# EAGLE schematic ESP12E Brain (EAGLE 9.3.0)
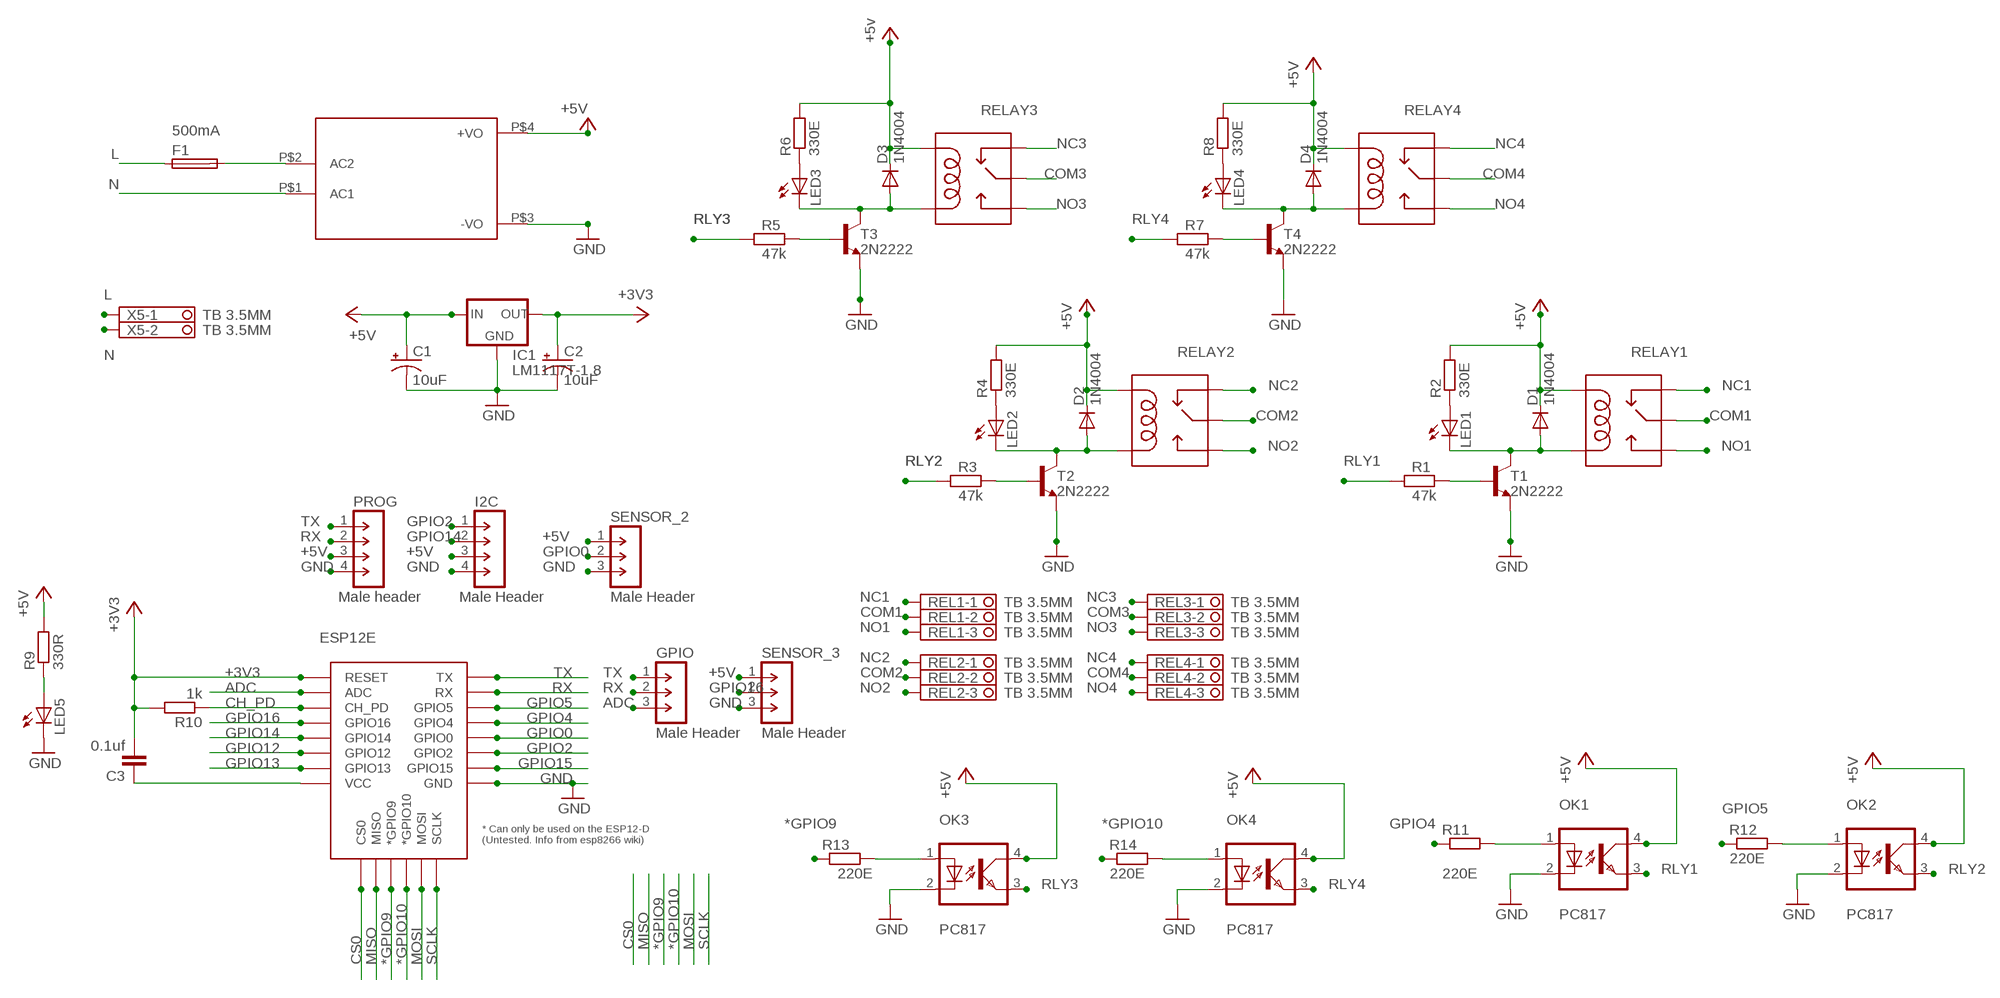
[diagram p0: schematic, sheet 1]

## Parts
C1  10uF  10UF-POLAR-RADIAL-2.5MM-25V-20%  [CPOL-RADIAL-2.5MM-5MM]
C2  10uF  10UF-POLAR-RADIAL-2.5MM-25V-20%  [CPOL-RADIAL-2.5MM-5MM]
C3  0.1uf  C-EU025-030X050  [C025-030X050]
D1  1N4004  [DO41-10]
D2  1N4004  [DO41-10]
D3  1N4004  [DO41-10]
D4  1N4004  [DO41-10]
ESP12E  ESP12ESMD  [ESP12E-SMD]
F1  500mA  FUSEBLANK_5X20MM  [FUSE_HOLDER_5X20MM]
GPIO  Male Header  M-1X03-SIP-100-32  [SIP-100-03-32]
HLK  HLK-PM013W  [HLK-PM01]
I2C  Male Header  M-1X04-SIP-100-32  [SIP-100-04-32]
IC1  LM1117T-1.8  [TO220]
LED1  LEDCHIP-LED0603  [CHIP-LED0603]
LED2  LEDCHIP-LED0603  [CHIP-LED0603]
LED3  LEDCHIP-LED0603  [CHIP-LED0603]
LED4  LEDCHIP-LED0603  [CHIP-LED0603]
LED5  LEDCHIP-LED0603  [CHIP-LED0603]
OK1  PC817  [DIL04]
OK2  PC817  [DIL04]
OK3  PC817  [DIL04]
OK4  PC817  [DIL04]
PROG  Male header  M-1X04-SIP-100-32  [SIP-100-04-32]
R1  47k  R-EU_0204/7  [0204/7]
R2  330E  R-EU_0204/7  [0204/7]
R3  47k  R-EU_0204/7  [0204/7]
R4  330E  R-EU_0204/7  [0204/7]
R5  47k  R-EU_0204/7  [0204/7]
R6  330E  R-EU_0204/7  [0204/7]
R7  47k  R-EU_0204/7  [0204/7]
R8  330E  R-EU_0204/7  [0204/7]
R9  330R  R-EU_0204/7  [0204/7]
R10  1k  R-EU_0204/7  [0204/7]
R11  220E  R-EU_0204/7  [0204/7]
R12  220E  R-EU_0204/7  [0204/7]
R13  220E  R-EU_0204/7  [0204/7]
R14  220E  R-EU_0204/7  [0204/7]
REL1  TB 3.5MM  TERMINAL-BLOCK-3.5MM-3-PIN-ROUND-PAD  [TERMINAL-BLOCK-3-PIN-3.5MM-ROUND-PAD]
REL2  TB 3.5MM  TERMINAL-BLOCK-3.5MM-3-PIN-ROUND-PAD  [TERMINAL-BLOCK-3-PIN-3.5MM-ROUND-PAD]
REL3  TB 3.5MM  TERMINAL-BLOCK-3.5MM-3-PIN-ROUND-PAD  [TERMINAL-BLOCK-3-PIN-3.5MM-ROUND-PAD]
REL4  TB 3.5MM  TERMINAL-BLOCK-3.5MM-3-PIN-ROUND-PAD  [TERMINAL-BLOCK-3-PIN-3.5MM-ROUND-PAD]
RELAY1  SRD-0XVDC-SL-CSRD-05VDC-SL-C  [SRD-0XVDC-SL-C]
RELAY2  SRD-0XVDC-SL-CSRD-05VDC-SL-C  [SRD-0XVDC-SL-C]
RELAY3  SRD-0XVDC-SL-CSRD-05VDC-SL-C  [SRD-0XVDC-SL-C]
RELAY4  SRD-0XVDC-SL-CSRD-05VDC-SL-C  [SRD-0XVDC-SL-C]
SENSOR_2  Male Header  M-1X03-SIP-100-32  [SIP-100-03-32]
SENSOR_3  Male Header  M-1X03-SIP-100-32  [SIP-100-03-32]
T1  2N2222  [TO92-EBC-OVAL]
T2  2N2222  [TO92-EBC-OVAL]
T3  2N2222  [TO92-EBC-OVAL]
T4  2N2222  [TO92-EBC-OVAL]
X5  TB 3.5MM  TERMINAL-BLOCK-3.5MM-2-PIN-ROUND-PAD  [TERMINAL-BLOCK-2-PIN-3.5MM-ROUND-PAD]

## Nets
*GPIO9: ESP12E.GPIO9(*GPIO9) R13.1
*GPIO10: ESP12E.GPIO10(*GPIO10) R14.1
+3V3: C2.1(+) C3.2 ESP12E.RESET IC1.2(OUT) R10.2
+5V: C1.1(+) D1.C D2.C D3.C D4.C HLK.P$4(+VO) I2C.3 IC1.3(IN) OK1.4(COL) OK2.4(COL) OK3.4(COL) OK4.4(COL) PROG.3 R2.2 R4.2 R6.2 R8.2 R9.2 RELAY1.COIL1 RELAY2.COIL1 RELAY3.COIL1 RELAY4.COIL1 SENSOR_2.1 SENSOR_3.1 ; supply symbol labelled +5v
AC2: F1.2 HLK.P$2(AC2)
ADC: ESP12E.ADC GPIO.3
CH_PD: ESP12E.CH_PD R10.1
COM1: REL1.2 RELAY1.SWCOMMON
COM2: REL2.2 RELAY2.SWCOMMON
COM3: REL3.2 RELAY3.SWCOMMON
COM4: REL4.2 RELAY4.SWCOMMON
CS0: ESP12E.CS0
GND: C1.2(-) C2.2(-) ESP12E.GND HLK.P$3(-VO) I2C.4 IC1.1(GND) LED5.C OK1.2(C) OK2.2(C) OK3.2(C) OK4.2(C) PROG.4 SENSOR_2.3 SENSOR_3.3 T1.E T2.E T3.E T4.E
GPIO0: ESP12E.GPIO0 SENSOR_2.2
GPIO2: ESP12E.GPIO2 I2C.1
GPIO4: ESP12E.GPIO4 R11.1
GPIO5: ESP12E.GPIO5 R12.1
GPIO12: ESP12E.GPIO12
GPIO13: ESP12E.GPIO13
GPIO14: ESP12E.GPIO14 I2C.2
GPIO15: ESP12E.GPIO15
GPIO16: ESP12E.GPIO16 SENSOR_3.2
L: F1.1 X5.1
MISO: ESP12E.MISO
MOSI: ESP12E.MOSI
N: HLK.P$1(AC1) X5.2
N$1: R1.2 T1.B
N$2: D1.A LED1.C RELAY1.COIL0 T1.C
N$3: OK1.1(A) R11.2
N$4: D2.A LED2.C RELAY2.COIL0 T2.C
N$6: LED1.A R2.1
N$7: R3.2 T2.B
N$8: LED2.A R4.1
N$9: D3.A LED3.C RELAY3.COIL0 T3.C
N$10: OK2.1(A) R12.2
N$11: R5.2 T3.B
N$12: LED3.A R6.1
N$13: D4.A LED4.C RELAY4.COIL0 T4.C
N$14: OK3.1(A) R13.2
N$15: R7.2 T4.B
N$16: LED4.A R8.1
N$17: C3.1 ESP12E.VCC
N$19: LED5.A R9.1
N$35: OK4.1(A) R14.2
NC1: REL1.1 RELAY1.SWCLOSED(SWCLOSE)
NC2: REL2.1 RELAY2.SWCLOSED(SWCLOSE)
NC3: REL3.1 RELAY3.SWCLOSED(SWCLOSE)
NC4: REL4.1 RELAY4.SWCLOSED(SWCLOSE)
NO1: REL1.3 RELAY1.SWOPEN
NO2: REL2.3 RELAY2.SWOPEN
NO3: REL3.3 RELAY3.SWOPEN
NO4: REL4.3 RELAY4.SWOPEN
RLY1: OK1.3(EMIT) R1.1
RLY2: OK2.3(EMIT) R3.1
RLY3: OK3.3(EMIT) R5.1
RLY4: OK4.3(EMIT) R7.1
RX: ESP12E.RXD0(RX) GPIO.2 PROG.2
SCLK: ESP12E.SCLK
TX: ESP12E.TXD0(TX) GPIO.1 PROG.1

## Library data of the parts
C1 C2 = SparkFun-Capacitors:10UF-POLAR: 10.0µF polarized capacitors A capacitor is a passive two-terminal electrical component used to store electrical energy temporarily in an electric field.; PROD_ID: CAP-08440
C3 = rcl:C-EU: CAPACITOR, European symbol; SPICEPREFIX: C
D1-D4 = adafruit:1N4004: DIODE General purpose 1N400x type rectifier (With bigger pads) http://www.ladyada.net/library/pcb/eaglelibrary.html
ESP12E = esp8266modules:ESP12E: ESP12E Module
F1 = fuse:FUSE: Fuse; OC_FARNELL: unknown; OC_NEWARK: unknown
GPIO SENSOR_2 SENSOR_3 = con-headers-jp:M-1X03-: MALE HEADER
HLK = HLK-PM01:HLK-PM01: Hi-Link Power Supply HLK-PM01 3W Author: Ahmed Said <https://github.com/AhmedSaid/EAGLELibraries>
I2C PROG = con-headers-jp:M-1X04-: MALE HEADER
IC1 = lm1117:LM1117T-*
LED1-LED5 = adafruit:LED: LED OSRAM: - CHIPLED LG R971, LG N971, LY N971, LG Q971, LY Q971, LO R971, LY R971 LH N974, LH R974 LS Q976, LO Q976, LY Q976 LO Q996 - Hyper CHIPLED LW Q18S LB Q993, LB Q99A, LB R99A - SideLED LS A670, LO A670, LY A670, LG A670, LP A670 LB A673, LV A673, LT A673, LW A673 LH A674 LY A675 LS A676, LA A676, LO A676, LY A676, LW A676 LS A679, LY A679, LG A679 - Hyper Micro SIDELED® LS Y876, LA Y876, LO Y876, LY Y876 LT Y87S - SmartLED LW L88C, LW L88S LB L89C, LB L89S, LG L890 LS L89K, LO L89K, LY L89K LS L896, LA L896, LO L896, LY L896 - TOPLED LS T670, LO T670, LY T670, LG T670, LP T670 LSG T670, LSP T670, LSY T670, LOP T670, LYG T670 LG T671, LOG T671, LSG T671 LB T673, LV T673, LT T673, LW T673 LH T674 LS T676, LA T676, LO T676, LY T676, LB T676, LH T676, LSB T676, LW T676 LB T67C, LV T67C, LT T67C, LS T67K, LO T67K, LY T67K, LW E67C LS E67B, LA E67B, LO E67B, LY E67B, LB E67C, LV E67C, LT E67C LW T67C LS T679, LY T679, LG T679 LS T770, LO T770, LY T770, LG T770, LP T770 LB T773, LV T773, LT T773, LW T773 LH T774 LS E675, LA E675, LY E675, LS T675 LS T776, LA T776, LO T776, LY T776, LB T776 LHGB T686 LT T68C, LB T68C - Hyper Mini TOPLED® LB M676 - Mini TOPLED Santana® LG M470 LS M47K, LO M47K, LY M47K Source: http://www.osram.convergy.de/
OK1-OK4 = optocoupler:PC817: SHARP OPTO COUPLER
R1 R3 R5 R7 = rcl:R-EU_: RESISTOR, European symbol; R1: 4.7k; SPICEPREFIX: 4.7k
R2 R4 R6 R8-R14 = rcl:R-EU_: RESISTOR, European symbol; SPICEPREFIX: R
REL1-REL4 = Rembrandt Electronics - Terminal Block 3-5mm v1-0:TERMINAL-BLOCK-3.5MM-3-PIN: Terminal Block 3.5mm Pitch: 3,5 mm Number of pins: 3 Created by Rembrandt Electronics www.rembrandtelectronics.com
RELAY1-RELAY4 = SRD-0XVDC-SL-C:SRD-0XVDC-SL-C: SRD-05VDC-SL-C SRD-06VDC-SL-C Compatible with: SONGLE Relays SHUN YU JQX-3F other same relays Author: Ahmed Said <https://github.com/AhmedSaid/EAGLELibraries>
T1-T4 = adafruit:2N2222: NPN TRANSISTOR Big oval pads
X5 = Rembrandt Electronics - Terminal Block 3-5mm v1-0:TERMINAL-BLOCK-3.5MM-2-PIN: Terminal Block 3.5mm Pitch: 3,5 mm Number of pins: 2 Created by Rembrandt Electronics www.rembrandtelectronics.com